# Altium schematic sheet Sheet2.SchDoc
size A2
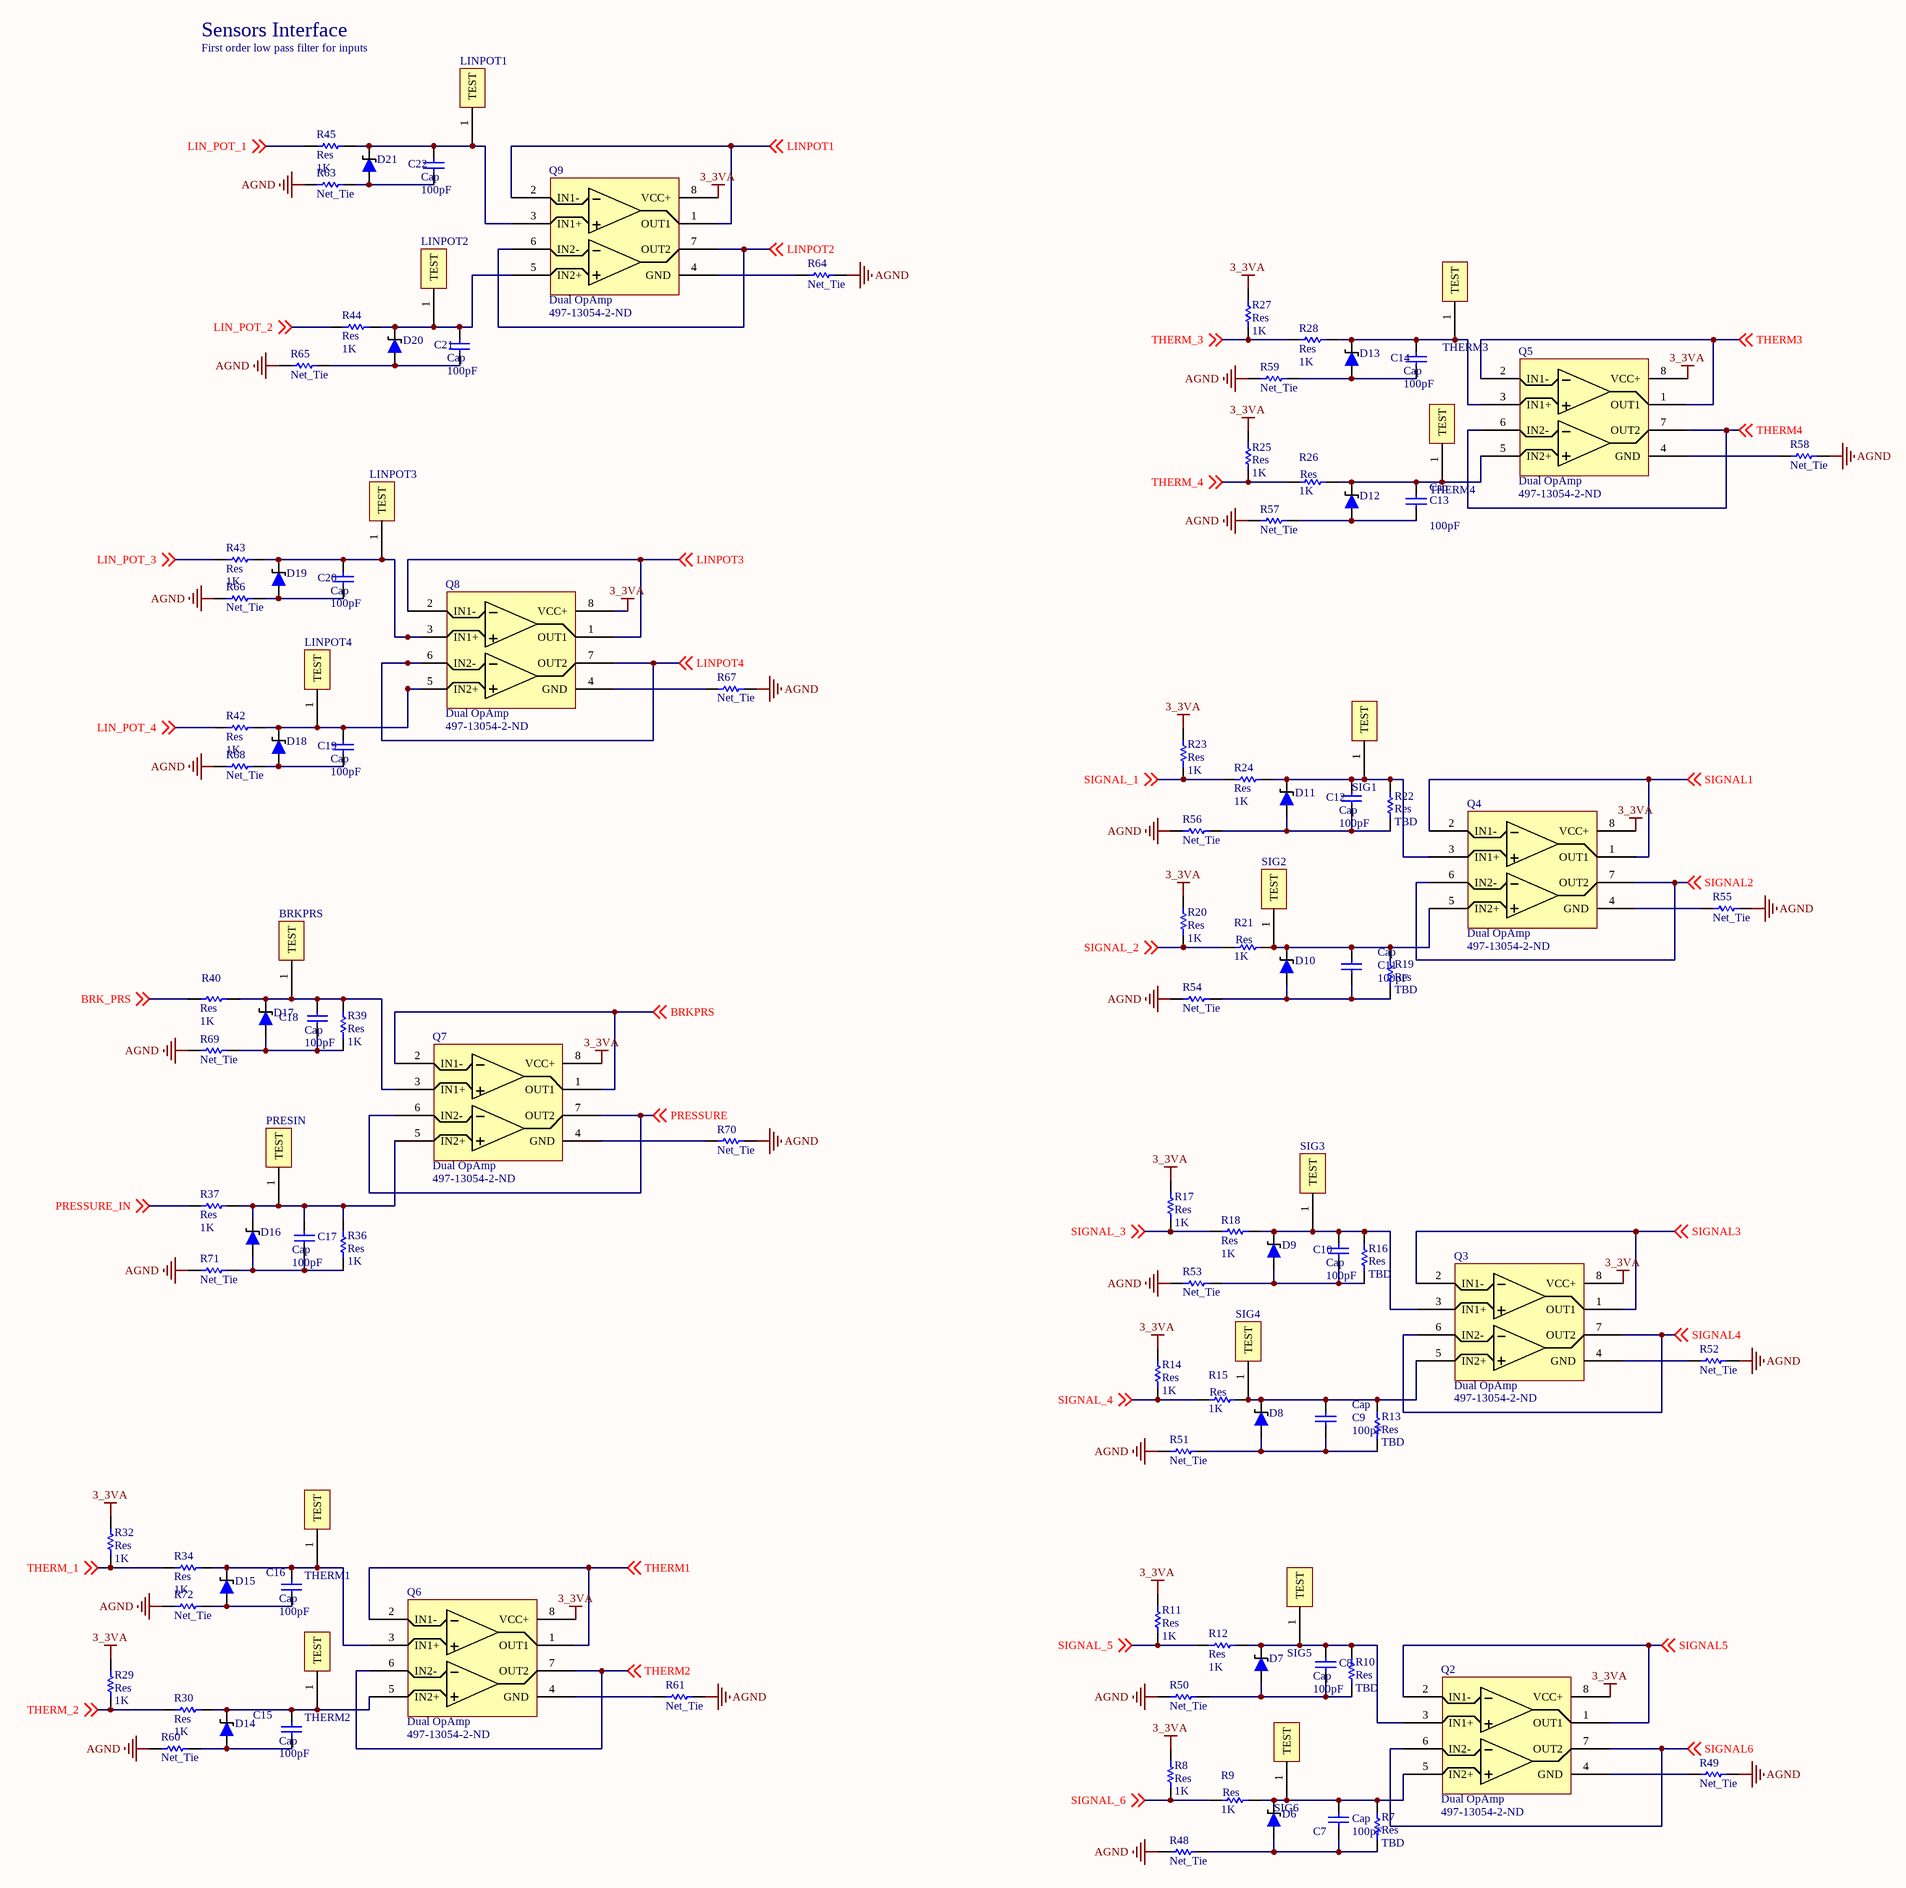
[diagram p0: Sheet2.SchDoc]

## Parts
C7  Cap  value 100pF  [C0805]
C8  Cap  value 100pF  [C0805]
C9  Cap  value 100pF  [C0805]
C10  Cap  value 100pF  [C0805]
C11  Cap  value 100pF  [C0805]
C12  Cap  value 100pF  [C0805]
C13  Cap  value 100pF  [C0805]
C14  Cap  value 100pF  [C0805]
C15  Cap  value 100pF  [C0805]
C16  Cap  value 100pF  [C0805]
C17  Cap  value 100pF  [C0805]
C18  Cap  value 100pF  [C0805]
C19  Cap  value 100pF  [C0805]
C20  Cap  value 100pF  [C0805]
C21  Cap  value 100pF  [C0805]
C22  Cap  value 100pF  [C0805]
D6  MMSZ4684-TP  [MMSZ4684/9]  (value not drawn)
D7  MMSZ4684-TP  [MMSZ4684/9]  (value not drawn)
D8  MMSZ4684-TP  [MMSZ4684/9]  (value not drawn)
D9  MMSZ4684-TP  [MMSZ4684/9]  (value not drawn)
D10  MMSZ4684-TP  [MMSZ4684/9]  (value not drawn)
D11  MMSZ4684-TP  [MMSZ4684/9]  (value not drawn)
D12  MMSZ4684-TP  [MMSZ4684/9]  (value not drawn)
D13  MMSZ4684-TP  [MMSZ4684/9]  (value not drawn)
D14  MMSZ4684-TP  [MMSZ4684/9]  (value not drawn)
D15  MMSZ4684-TP  [MMSZ4684/9]  (value not drawn)
D16  MMSZ4689-TP  [MMSZ4684/9]  (value not drawn)
D17  MMSZ4689-TP  [MMSZ4684/9]  (value not drawn)
D18  MMSZ4684-TP  [MMSZ4684/9]  (value not drawn)
D19  MMSZ4684-TP  [MMSZ4684/9]  (value not drawn)
D20  MMSZ4684-TP  [MMSZ4684/9]  (value not drawn)
D21  MMSZ4684-TP  [MMSZ4684/9]  (value not drawn)
Q2  Dual OpAmp  Supplier Part Number 1: 497-13054-2-ND  [LMV358LIDT]
Q3  Dual OpAmp  Supplier Part Number 1: 497-13054-2-ND  [LMV358LIDT]
Q4  Dual OpAmp  Supplier Part Number 1: 497-13054-2-ND  [LMV358LIDT]
Q5  Dual OpAmp  Supplier Part Number 1: 497-13054-2-ND  [LMV358LIDT]
Q6  Dual OpAmp  Supplier Part Number 1: 497-13054-2-ND  [LMV358LIDT]
Q7  Dual OpAmp  Supplier Part Number 1: 497-13054-2-ND  [LMV358LIDT]
Q8  Dual OpAmp  Supplier Part Number 1: 497-13054-2-ND  [LMV358LIDT]
Q9  Dual OpAmp  Supplier Part Number 1: 497-13054-2-ND  [LMV358LIDT]
R7  Res  value TBD  [2012[0805]]  (no BOM)
R8  Res  value 1K  [2012[0805]]
R9  Res  value 1K  [2012[0805]]
R10  Res  value TBD  [2012[0805]]  (no BOM)
R11  Res  value 1K  [2012[0805]]
R12  Res  value 1K  [2012[0805]]
R13  Res  value TBD  [2012[0805]]  (no BOM)
R14  Res  value 1K  [2012[0805]]
R15  Res  value 1K  [2012[0805]]
R16  Res  value TBD  [2012[0805]]  (no BOM)
R17  Res  value 1K  [2012[0805]]
R18  Res  value 1K  [2012[0805]]
R19  Res  value TBD  [2012[0805]]  (no BOM)
R20  Res  value 1K  [2012[0805]]
R21  Res  value 1K  [2012[0805]]
R22  Res  value TBD  [2012[0805]]  (no BOM)
R23  Res  value 1K  [2012[0805]]
R24  Res  value 1K  [2012[0805]]
R25  Res  value 1K  [2012[0805]]
R26  Res  value 1K  [2012[0805]]
R27  Res  value 1K  [2012[0805]]
R28  Res  value 1K  [2012[0805]]
R29  Res  value 1K  [2012[0805]]
R30  Res  value 1K  [2012[0805]]
R32  Res  value 1K  [2012[0805]]
R34  Res  value 1K  [2012[0805]]
R36  Res  value 1K  [2012[0805]]
R37  Res  value 1K  [2012[0805]]
R39  Res  value 1K  [2012[0805]]
R40  Res  value 1K  [2012[0805]]
R42  Res  value 1K  [2012[0805]]
R43  Res  value 1K  [2012[0805]]
R44  Res  value 1K  [2012[0805]]
R45  Res  value 1K  [2012[0805]]
R48  Net_Tie  [NetTie 0805 10mil]  (net tie, no BOM)
R49  Net_Tie  [NetTie 0805 10mil]  (net tie, no BOM)
R50  Net_Tie  [NetTie 0805 10mil]  (net tie, no BOM)
R51  Net_Tie  [NetTie 0805 10mil]  (net tie, no BOM)
R52  Net_Tie  [NetTie 0805 10mil]  (net tie, no BOM)
R53  Net_Tie  [NetTie 0805 10mil]  (net tie, no BOM)
R54  Net_Tie  [NetTie 0805 10mil]  (net tie, no BOM)
R55  Net_Tie  [NetTie 0805 10mil]  (net tie, no BOM)
R56  Net_Tie  [NetTie 0805 10mil]  (net tie, no BOM)
R57  Net_Tie  [NetTie 0805 10mil]  (net tie, no BOM)
R58  Net_Tie  [NetTie 0805 10mil]  (net tie, no BOM)
R59  Net_Tie  [NetTie 0805 10mil]  (net tie, no BOM)
R60  Net_Tie  [NetTie 0805 10mil]  (net tie, no BOM)
R61  Net_Tie  [NetTie 0805 10mil]  (net tie, no BOM)
R63  Net_Tie  [NetTie 0805 10mil]  (net tie, no BOM)
R64  Net_Tie  [NetTie 0805 10mil]  (net tie, no BOM)
R65  Net_Tie  [NetTie 0805 10mil]  (net tie, no BOM)
R66  Net_Tie  [NetTie 0805 10mil]  (net tie, no BOM)
R67  Net_Tie  [NetTie 0805 10mil]  (net tie, no BOM)
R68  Net_Tie  [NetTie 0805 10mil]  (net tie, no BOM)
R69  Net_Tie  [NetTie 0805 10mil]  (net tie, no BOM)
R70  Net_Tie  [NetTie 0805 10mil]  (net tie, no BOM)
R71  Net_Tie  [NetTie 0805 10mil]  (net tie, no BOM)
R72  Net_Tie  [NetTie 0805 10mil]  (net tie, no BOM)
TP1  SIG6  [TEST POINT 5000K]
TP2  SIG5  [TEST POINT 5000K]
TP3  SIG4  [TEST POINT 5000K]
TP4  SIG3  [TEST POINT 5000K]
TP5  SIG2  [TEST POINT 5000K]
TP6  SIG1  [TEST POINT 5000K]
TP7  THERM4  [TEST POINT 5000K]
TP8  THERM3  [TEST POINT 5000K]
TP9  THERM2  [TEST POINT 5000K]
TP10  THERM1  [TEST POINT 5000K]
TP11  PRESIN  [TEST POINT 5000K]
TP12  BRKPRS  [TEST POINT 5000K]
TP13  LINPOT4  [TEST POINT 5000K]
TP14  LINPOT3  [TEST POINT 5000K]
TP15  LINPOT2  [TEST POINT 5000K]
TP16  LINPOT1  [TEST POINT 5000K]

## Nets
3_3VA: Q2.8(VCC+) Q3.8(VCC+) Q4.8(VCC+) Q5.8(VCC+) Q6.8(VCC+) Q7.8(VCC+) Q8.8(VCC+) Q9.8(VCC+) R8.2 R11.2 R14.2 R17.2 R20.2 R23.2 R25.2 R27.2 R29.2 R32.2
AGND: R48.2 R49.2 R50.2 R51.2 R52.2 R53.2 R54.2 R55.2 R56.2 R57.2 R58.2 R59.2 R60.2 R61.2 R63.1 R64.2 R65.1 R66.2 R67.2 R68.2 R69.2 R70.2 R71.2 R72.2
BRK_PRS: R40.1 ; off-sheet BRK_PRS
BRKPRS: Q7.1(OUT1) Q7.2(IN1-) ; off-sheet BRKPRS
LIN_POT_1: R45.1 ; off-sheet LIN_POT_1
LIN_POT_2: R44.1 ; off-sheet LIN_POT_2
LIN_POT_3: R43.1 ; off-sheet LIN_POT_3
LIN_POT_4: R42.1 ; off-sheet LIN_POT_4
LINPOT1: Q9.1(OUT1) Q9.2(IN1-) ; off-sheet LINPOT1
LINPOT2: Q9.6(IN2-) Q9.7(OUT2) ; off-sheet LINPOT2
LINPOT3: Q8.1(OUT1) Q8.2(IN1-) ; off-sheet LINPOT3
LINPOT4: Q8.6(IN2-) Q8.7(OUT2) ; off-sheet LINPOT4
PRESSURE: Q7.6(IN2-) Q7.7(OUT2) ; off-sheet PRESSURE
PRESSURE_IN: R37.1 ; off-sheet PRESSURE_IN
SIGNAL1: Q4.1(OUT1) Q4.2(IN1-) ; off-sheet SIGNAL1
SIGNAL2: Q4.6(IN2-) Q4.7(OUT2) ; off-sheet SIGNAL2
SIGNAL3: Q3.1(OUT1) Q3.2(IN1-) ; off-sheet SIGNAL3
SIGNAL4: Q3.6(IN2-) Q3.7(OUT2) ; off-sheet SIGNAL4
SIGNAL5: Q2.1(OUT1) Q2.2(IN1-) ; off-sheet SIGNAL5
SIGNAL6: Q2.6(IN2-) Q2.7(OUT2) ; off-sheet SIGNAL6
SIGNAL_1: R23.1 R24.1 ; off-sheet SIGNAL_1
SIGNAL_2: R20.1 R21.1 ; off-sheet SIGNAL_2
SIGNAL_3: R17.1 R18.1 ; off-sheet SIGNAL_3
SIGNAL_4: R14.1 R15.1 ; off-sheet SIGNAL_4
SIGNAL_5: R11.1 R12.1 ; off-sheet SIGNAL_5
SIGNAL_6: R8.1 R9.1 ; off-sheet SIGNAL_6
THERM1: Q6.1(OUT1) Q6.2(IN1-) ; off-sheet THERM1
THERM2: Q6.6(IN2-) Q6.7(OUT2) ; off-sheet THERM2
THERM3: Q5.1(OUT1) Q5.2(IN1-) ; off-sheet THERM3
THERM4: Q5.6(IN2-) Q5.7(OUT2) ; off-sheet THERM4
THERM_1: R32.1 R34.1 ; off-sheet THERM_1
THERM_2: R29.1 R30.1 ; off-sheet THERM_2
THERM_3: R27.1 R28.1 ; off-sheet THERM_3
THERM_4: R25.1 R26.1 ; off-sheet THERM_4
NetC7_1: C7.1 D6.1 R7.2 R48.1
NetC7_2: C7.2 D6.2 Q2.5(IN2+) R7.1 R9.2 TP1.1(TEST)
NetC8_1: C8.1 D7.1 R10.2 R50.1
NetC8_2: C8.2 D7.2 Q2.3(IN1+) R10.1 R12.2 TP2.1(TEST)
NetC9_1: C9.1 D8.1 R13.2 R51.1
NetC9_2: C9.2 D8.2 Q3.5(IN2+) R13.1 R15.2 TP3.1(TEST)
NetC10_1: C10.1 D9.1 R16.2 R53.1
NetC10_2: C10.2 D9.2 Q3.3(IN1+) R16.1 R18.2 TP4.1(TEST)
NetC11_1: C11.1 D10.1 R19.2 R54.1
NetC11_2: C11.2 D10.2 Q4.5(IN2+) R19.1 R21.2 TP5.1(TEST)
NetC12_1: C12.1 D11.1 R22.2 R56.1
NetC12_2: C12.2 D11.2 Q4.3(IN1+) R22.1 R24.2 TP6.1(TEST)
NetC13_1: C13.1 D12.1 R57.1
NetC13_2: C13.2 D12.2 Q5.5(IN2+) R26.2 TP7.1(TEST)
NetC14_1: C14.1 D13.1 R59.1
NetC14_2: C14.2 D13.2 Q5.3(IN1+) R28.2 TP8.1(TEST)
NetC15_1: C15.1 D14.1 R60.1
NetC15_2: C15.2 D14.2 Q6.5(IN2+) R30.2 TP9.1(TEST)
NetC16_1: C16.1 D15.1 R72.1
NetC16_2: C16.2 D15.2 Q6.3(IN1+) R34.2 TP10.1(TEST)
NetC17_1: C17.1 D16.1 R36.1 R71.1
NetC17_2: C17.2 D16.2 Q7.5(IN2+) R36.2 R37.2 TP11.1(TEST)
NetC18_1: C18.1 D17.1 R39.1 R69.1
NetC18_2: C18.2 D17.2 Q7.3(IN1+) R39.2 R40.2 TP12.1(TEST)
NetC19_1: C19.1 D18.1 R68.1
NetC19_2: C19.2 D18.2 Q8.5(IN2+) R42.2 TP13.1(TEST)
NetC20_1: C20.1 D19.1 R66.1
NetC20_2: C20.2 D19.2 Q8.3(IN1+) R43.2 TP14.1(TEST)
NetC21_1: C21.1 D20.1 R65.2
NetC21_2: C21.2 D20.2 Q9.5(IN2+) R44.2 TP15.1(TEST)
NetC22_1: C22.1 D21.1 R63.2
NetC22_2: C22.2 D21.2 Q9.3(IN1+) R45.2 TP16.1(TEST)
NetQ2_4: Q2.4(GND) R49.1
NetQ3_4: Q3.4(GND) R52.1
NetQ4_4: Q4.4(GND) R55.1
NetQ5_4: Q5.4(GND) R58.1
NetQ6_4: Q6.4(GND) R61.1
NetQ7_4: Q7.4(GND) R70.1
NetQ8_4: Q8.4(GND) R67.1
NetQ9_4: Q9.4(GND) R64.1

## Notes on the sheet
- Sensors Interface
- First order low pass filter for inputs

## Library data of the parts
C7-C22 = Cap: Capacitor; Published: 8-Jun-2000; LatestRevisionDate: 17-Jul-2002; LatestRevisionNote: Re-released for DXP Platform.; PackageReference: C1206; Publisher: Altium Limited
D6-D15 D18-D21 = MMSZ4684-TP: Zener Diode 3.3; Supplier 1: Digi-Key; Supplier Part Number 1: MMSZ4684-TPMSTR-ND
D16 D17 = MMSZ4689-TP: Zener Diode 5.1; Supplier 1: Digi-Key
Q2-Q9 = LMV358LIDT: Standard Dual OpAmp; Supplier 1: Digi-Key
R7-R30 R32 R34 R36 R37 R39 R40 R42-R45 = Res: Surface Mount Resistor; Published: 8-Jun-2000; LatestRevisionDate: 17-Jul-2002; LatestRevisionNote: Re-released for DXP Platform.; PackageReference: AXIAL-0.5; Publisher: Altium Limited
R48-R61 R63-R72 = Res_NetTie: Surface Mount Resistor
TP1-TP16 = Test Point: 5000-5004, 5015-5019 Keystone Electronics